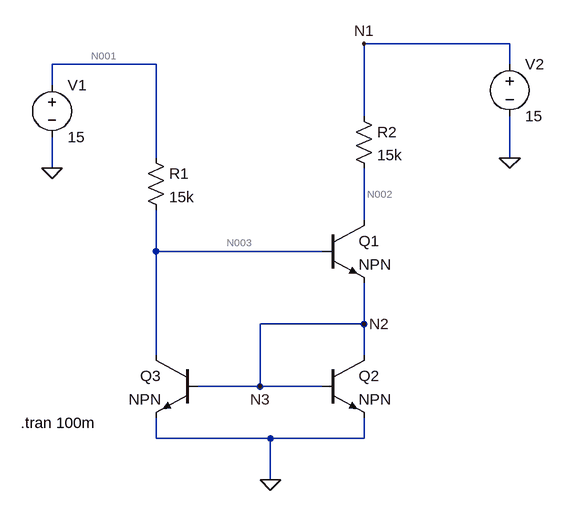
[diagram p0: schematic BJT current Mirror (Prac1).asc]
BJT current Mirror (Prac1).asc, the LTspice schematic file:
Version 4
SHEET 1 880 708
WIRE 592 16 368 16
WIRE 48 48 -112 48
WIRE 592 48 592 16
WIRE -112 80 -112 48
WIRE 368 128 368 16
WIRE 48 192 48 48
WIRE 592 192 592 128
WIRE -112 208 -112 160
WIRE 368 288 368 208
WIRE 48 336 48 272
WIRE 304 336 48 336
WIRE 368 448 368 384
WIRE 368 448 208 448
WIRE 48 496 48 336
WIRE 368 496 368 448
WIRE 208 544 208 448
WIRE 208 544 112 544
WIRE 304 544 208 544
WIRE 48 624 48 592
WIRE 224 624 48 624
WIRE 368 624 368 592
WIRE 368 624 224 624
WIRE 224 688 224 624
FLAG 224 688 0
FLAG 592 192 0
FLAG -112 208 0
FLAG 368 16 N1
FLAG 368 448 N2
FLAG 208 544 N3
SYMBOL voltage -112 64 R0
SYMATTR InstName V1
SYMATTR Value 15
SYMBOL voltage 592 32 R0
SYMATTR InstName V2
SYMATTR Value 15
SYMBOL npn 304 288 R0
SYMATTR InstName Q1
SYMBOL npn 304 496 R0
SYMATTR InstName Q2
SYMBOL npn 112 496 M0
SYMATTR InstName Q3
SYMBOL res 32 176 R0
SYMATTR InstName R1
SYMATTR Value 15k
SYMBOL res 352 112 R0
SYMATTR InstName R2
SYMATTR Value 15k
TEXT -160 600 Left 2 !.tran 100m

The netlist it stands for:
* BJT current Mirror (Prac1).asc
V1 N001 0 15
V2 N1 0 15
Q1 N002 N003 N3 0 NPN
Q2 N3 N3 0 0 NPN
Q3 N003 N3 0 0 NPN
R1 N001 N003 15k
R2 N1 N002 15k
.model NPN NPN
.model PNP PNP
.lib standard.bjt
.tran 100m
.backanno
.end

* Results of the author's LTspice run, read from the files saved beside the schematic
* Operating Point, zero values left out:
*   V(n001) = 15 V
*   V(n1) = 15 V
*   V(n002) = 1.545 V
*   V(n003) = 1.543 V
*   V(n3) = 771.2 mV
*   Ic(Q3) = 888.2 µA
*   Ib(Q3) = 8.882 µA
*   Ie(Q3) = -897.1 µA
*   Ic(Q2) = 888.2 µA
*   Ib(Q2) = 8.882 µA
*   Ie(Q2) = -897.1 µA
*   Ic(Q1) = 897 µA
*   Ib(Q1) = 8.97 µA
*   Ie(Q1) = -906 µA
*   I(R2) = 897 µA
*   I(R1) = 897.2 µA
*   I(V2) = -897 µA
*   I(V1) = -897.2 µA